# Altium project PCB_Project1.PrjPCB
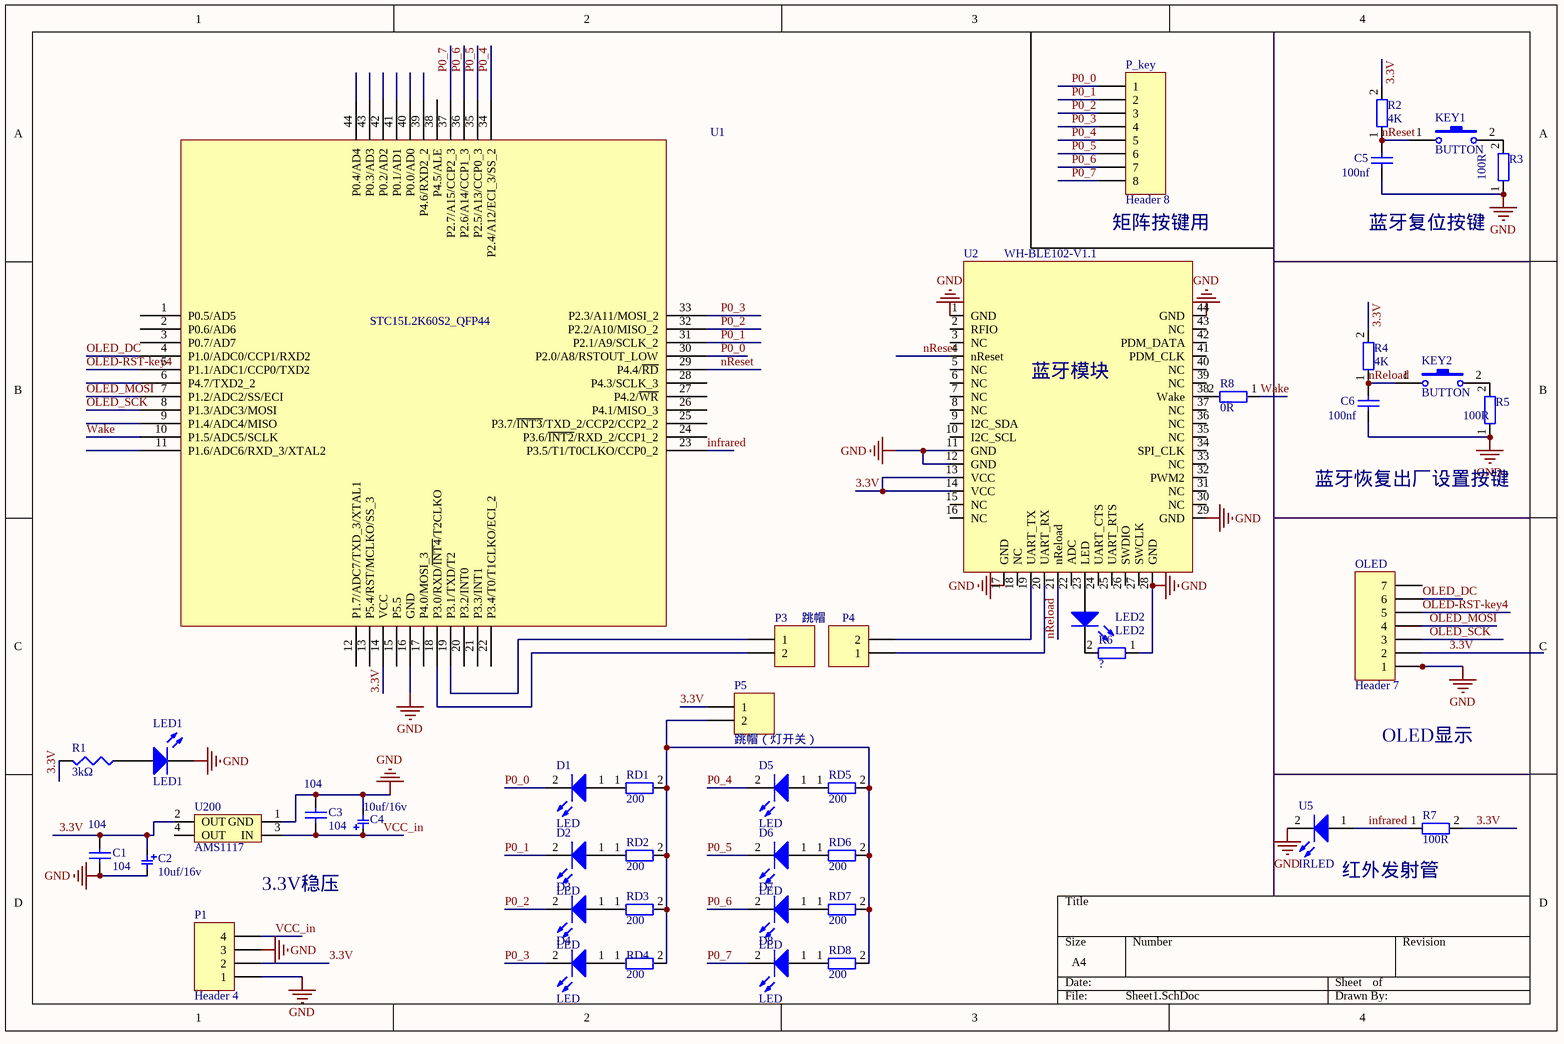
[diagram p0: Sheet1.SchDoc]
1 sheet, 44 parts. Net scope: global (net labels, ports and power ports of the same name join across sheets).
Board file: PCB.PcbDoc

## Sheet Sheet1.SchDoc
size A4

### Parts
C1  104  [0805-2]
C2  10uf/16v  [SMD-EC-F5]
C3  104  [0805-2]
C4  10uf/16v  [SMD-EC-F5]
C5  value 100nf  [0805-2]
C6  value 100nf  [0805-2]
D1  LED  [SMDLED]
D2  LED  [SMDLED]
D3  LED  [SMDLED]
D4  LED  [SMDLED]
D5  LED  [SMDLED]
D6  LED  [SMDLED]
D7  LED  [SMDLED]
D8  LED  [SMDLED]
KEY1  BUTTON  [BUTTON贴片按键3*6*2.5]
KEY2  BUTTON  [BUTTON贴片按键3*6*2.5]
LED1  LED1  [SMDLED]
LED2  LED2  [SMDLED]
OLED  Header 7  [HDR1X7]
P1  Header 4  [HDR1X4]
P3  跳帽  [HDR1X2]
P4  (no value)  [HDR1X2]
P5  跳帽（灯开关）  [HDR1X2]
P_key  Header 8  [HDR1X8]
R1  3kΩ  [贴片0805-有丝印]
R2  4K  [贴片0805-有丝印]
R3  100R  [贴片0805-有丝印]
R4  4K  [贴片0805-有丝印]
R5  100R  [贴片0805-有丝印]
R6  ?  [贴片0805-有丝印]
R7  100R  [贴片0805-有丝印]
R8  0R  [贴片0805-有丝印]
RD1  200  [贴片0805-有丝印]
RD2  200  [贴片0805-有丝印]
RD3  200  [贴片0805-有丝印]
RD4  200  [贴片0805-有丝印]
RD5  200  [贴片0805-有丝印]
RD6  200  [贴片0805-有丝印]
RD7  200  [贴片0805-有丝印]
RD8  200  [贴片0805-有丝印]
U1  STC15L2K60S2_QFP44  [PQFP44]
U2  WH-BLE102-V1.1  [WH-BLE102-V1.1]
U5  IRLED  [LED-1]
U200  AMS1117  [ASM117稳压芯片]

### Nets
GND: C1.1 C2.2 C3.2 C4.2 C5.1 C6.1 LED1.2(K) OLED.1 P1.1 P1.3 R3.1 R5.1 R6.1 U1.16(GND) U2.1(GND) U2.11(GND) U2.12(GND) U2.17(GND) U2.28(GND) U2.29(GND) U2.44(GND) U5.2(K) U200.1(GND)
3.3V: C1.2 C2.1 OLED.2 P1.2 P5.1 R1.2 R2.2 R4.2 R7.2 U1.14(VCC) U2.13(VCC) U2.14(VCC) U200.2(OUT)
infrared: R7.1 U1.23(P3.5/T1/T0CLKO/CCP0_2) U5.1(A)
nReload: C6.2 KEY2.1 R4.1 U2.21(nReload)
nReset: C5.2 KEY1.1 R2.1 U1.29(P4.4/~{RD}) U2.4(nReset)
OLED-RST-key4: OLED.5 U1.5(P1.1/ADC1/CCP0/TXD2)
OLED_DC: OLED.6 U1.4(P1.0/ADC0/CCP1/RXD2)
OLED_MOSI: OLED.4 U1.7(P1.2/ADC2/SS/ECI)
OLED_SCK: OLED.3 U1.8(P1.3/ADC3/MOSI)
P0_0: D1.2(K) P_key.1 U1.30(P2.0/A8/RSTOUT_LOW)
P0_1: D2.2(K) P_key.2 U1.31(P2.1/A9/SCLK_2)
P0_2: D3.2(K) P_key.3 U1.32(P2.2/A10/MISO_2)
P0_3: D4.2(K) P_key.4 U1.33(P2.3/A11/MOSI_2)
P0_4: D5.2(K) P_key.5 U1.34(P2.4/A12/ECI_3/SS_2)
P0_5: D6.2(K) P_key.6 U1.35(P2.5/A13/CCP0_3)
P0_6: D7.2(K) P_key.7 U1.36(P2.6/A14/CCP1_3)
P0_7: D8.2(K) P_key.8 U1.37(P2.7/A15/CCP2_3)
VCC_in: C3.1 C4.1 P1.4 U200.3(IN)
Wake: R8.1 U1.10(P1.5/ADC5/SCLK)
NetD1_1: D1.1(A) RD1.1
NetD2_1: D2.1(A) RD2.1
NetD3_1: D3.1(A) RD3.1
NetD4_1: D4.1(A) RD4.1
NetD5_1: D5.1(A) RD5.1
NetD6_1: D6.1(A) RD6.1
NetD7_1: D7.1(A) RD7.1
NetD8_1: D8.1(A) RD8.1
NetKEY1_2: KEY1.2 R3.2
NetKEY2_2: KEY2.2 R5.2
NetLED1_1: LED1.1(A) R1.1
NetLED2_1: LED2.1(A) U2.23(LED)
NetLED2_2: LED2.2(K) R6.2
NetP3_1: P3.1 U1.19(P3.1/TXD/T2)
NetP3_2: P3.2 U1.18(P3.0/RXD/~{INT4}/T2CLKO)
NetP4_1: P4.1 U2.20(UART_RX)
NetP4_2: P4.2 U2.19(UART_TX)
NetP5_2: P5.2 RD1.2 RD2.2 RD3.2 RD4.2 RD5.2 RD6.2 RD7.2 RD8.2
NetR8_2: R8.2 U2.38(Wake)

Not connected (* = marked no-connect by the designer): OLED 7; U1 1(P0.5/AD5) 2(P0.6/AD6) 3(P0.7/AD7) 6(P4.7/TXD2_2) 9(P1.4/ADC4/MISO) 11(P1.6/ADC6/RXD_3/XTAL2) 12(P1.7/ADC7/TXD_3/XTAL1) 13(P5.4/RST/MCLKO/SS_3) 15(P5.5) 17(P4.0/MOSI_3) 20(P3.2/INT0) 21(P3.3/INT1) 22(P3.4/T0/T1CLKO/ECI_2) 24(P3.6/~{INT2}/RXD_2/CCP1_2) 25(P3.7/~{INT3}/TXD_2/CCP2/CCP2_2) 26(P4.1/MISO_3) 27(P4.2/~{WR}) 28(P4.3/SCLK_3) 38(P4.5/ALE) 39(P4.6/RXD2_2) 40(P0.0/AD0) 41(P0.1/AD1) 42(P0.2/AD2) 43(P0.3/AD3) 44(P0.4/AD4); U2 2(RFIO) 3(NC) 5(NC) 6(NC) 7(NC) 8(NC) 9(I2C_SDA) 10(I2C_SCL) 15(NC) 16(NC) 18(NC) 22(ADC) 24(UART_CTS) 25(UART_RTS) 26(SWDIO) 27(SWCLK) 30(NC) 31(NC) 32(PWM2) 33(NC) 34(SPI_CLK) 35(NC) 36(NC) 37(NC) 39(NC) 40(NC) 41(PDM_CLK) 42(PDM_DATA) 43(NC); U200 4(OUT)

### Notes on the sheet
- (near P_key) 矩阵按键用
- (near C5) 蓝牙复位按键
- (near U2) 蓝牙模块
- 蓝牙恢复出厂设置按键
- OLED显示
- 3.3V稳压
- 红外发射管

### Library data of the parts
C1 C3 C5 C6 = Cap: 无极性电容; Published: 8-Jun-2000; LatestRevisionDate: 17-Jul-2002; LatestRevisionNote: Re-released for DXP Platform.; PackageReference: RAD-0.3; Publisher: Altium Limited
  C1 C3: Value: 104
C2 C4 = ECAP
LED1 LED2 = LED2: Typical RED, GREEN, YELLOW, AMBER GaAs LED; Published: *; LatestRevisionDate: *; LatestRevisionNote: *; PackageDocument: *; PackageReference: *; Publisher: *
OLED = Header 7: Header, 7-Pin; LatestRevisionDate: 17-Jul-2002; LatestRevisionNote: Re-released for DXP Platform.; Publisher: Altium Limited
P1 = Header 4: Header, 4-Pin; LatestRevisionDate: 17-Jul-2002; LatestRevisionNote: Re-released for DXP Platform.; Publisher: Altium Limited
P3-P5 = Header 2: Header, 2-Pin; LatestRevisionDate: 17-Jul-2002; LatestRevisionNote: Re-released for DXP Platform.; Publisher: Altium Limited
P_key = Header 8: Header, 8-Pin; LatestRevisionDate: 17-Jul-2002; LatestRevisionNote: Re-released for DXP Platform.; Publisher: Altium Limited
R1 = Res3: Resistor; Published: 8-Jun-2000; LatestRevisionDate: 29-May-2009; LatestRevisionNote: IPC-7351 Footprint Added.; PackageReference: J1-0603; Publisher: Altium Limited; PackageDescription: Chip Resistor
R2-R8 RD1-RD8 = RES
U1 = STC15F2K60S2_QFP44
U5 = LED